# Altium schematic sheet xm124.SchDoc
size A4; SheetNumber: 5; SheetTotal: 7
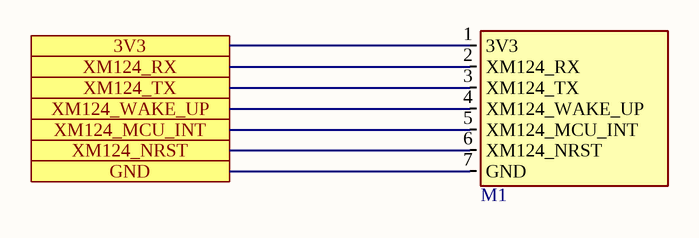
[diagram p0: xm124.SchDoc]

## Parts
M1  BME radar module  [BME_RADAR_MODULE]  (value not drawn)

## Ports
3V3, GND, XM124_MCU_INT, XM124_NRST, XM124_RX, XM124_TX, XM124_WAKE_UP

## Nets
3V3: M1.1(3V3) ; port 3V3
GND: M1.7(GND) ; port GND
XM124_MCU_INT: M1.5(XM124_MCU_INT) ; port XM124_MCU_INT
XM124_NRST: M1.6(XM124_NRST) ; port XM124_NRST
XM124_RX: M1.2(XM124_RX) ; port XM124_RX
XM124_TX: M1.3(XM124_TX) ; port XM124_TX
XM124_WAKE_UP: M1.4(XM124_WAKE_UP) ; port XM124_WAKE_UP

## Library data of the parts
M1 = BME radar module: XM124  Radar module; Manufacturer Part No: RSM-107-02-L-S; Value: 1x8 Pin Header